# Altium schematic sheet Mirny.schdoc: Mirny
size A2; EDA_Number: ARTIQ; Projet: ARTIQ/SINARA; Author: M.Beldyga; CompanyName: WUT ISE; DrawnBy: K.B; Organization: WUT ISE; Address1: PW ISE; Address2: Nowowiejska 15/19 00-665 Warsaw; Address3: micbeldyga@gmail.com; SheetNumber: 1; SheetTotal: 10; ModifiedBy: M. Beldyga; CheckedDate: -; DivGrp: WUT ISE; Designer: K.B; ModifiedDate: -; ProjectName: Sensor Box
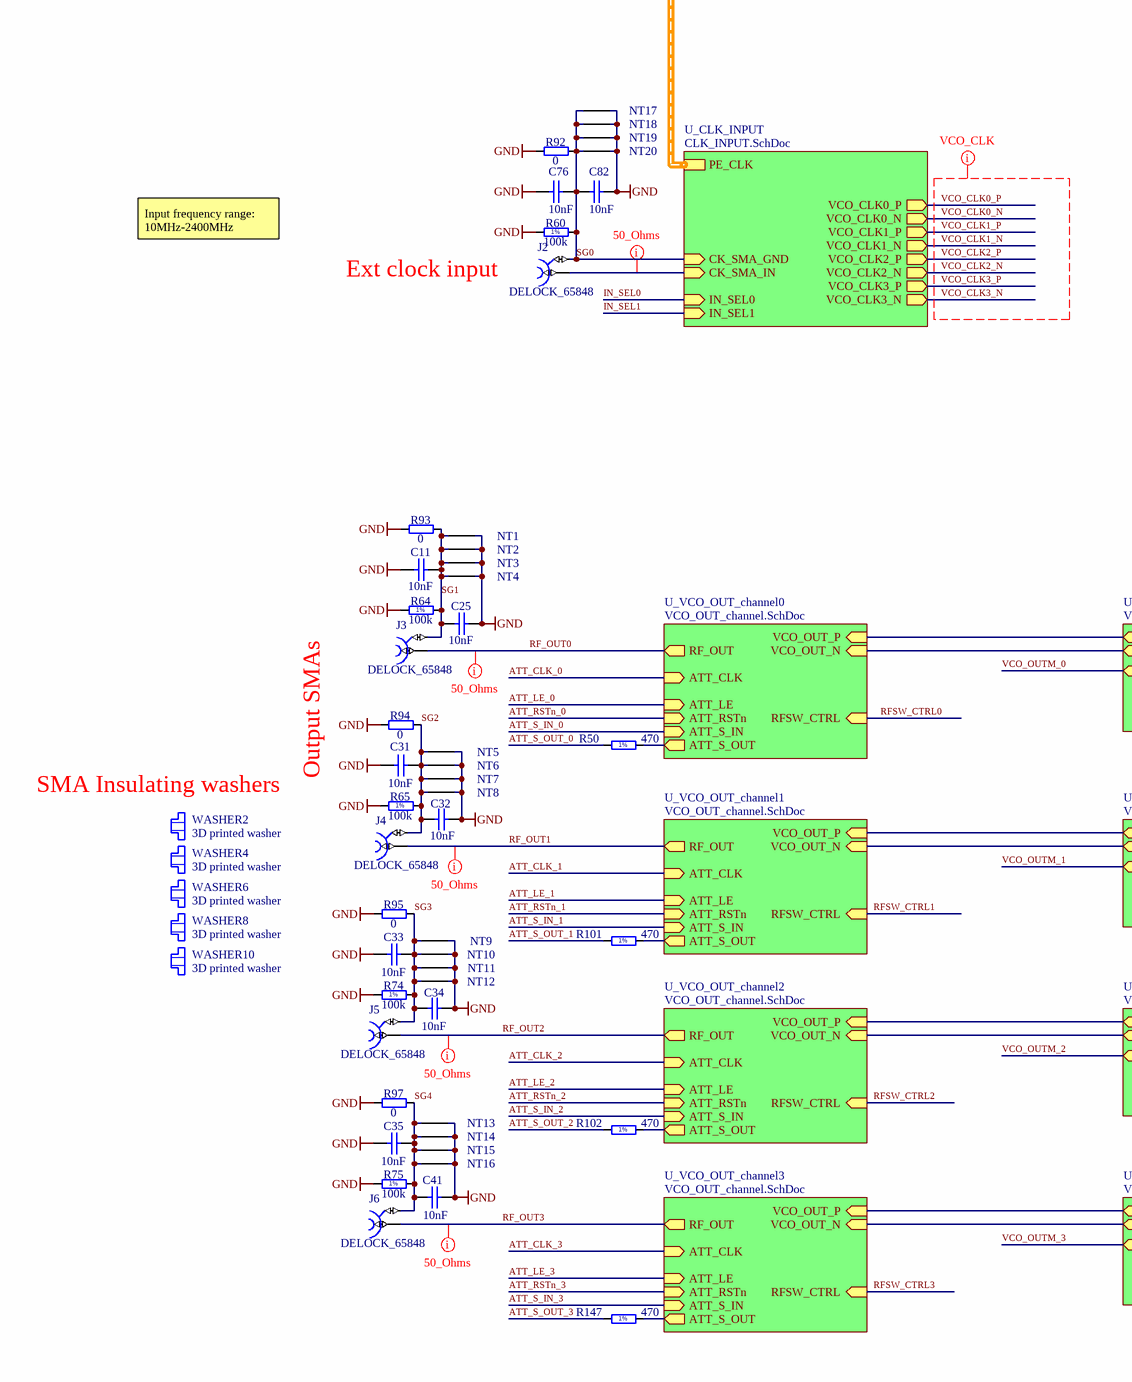
[diagram p0: Mirny.schdoc, left]
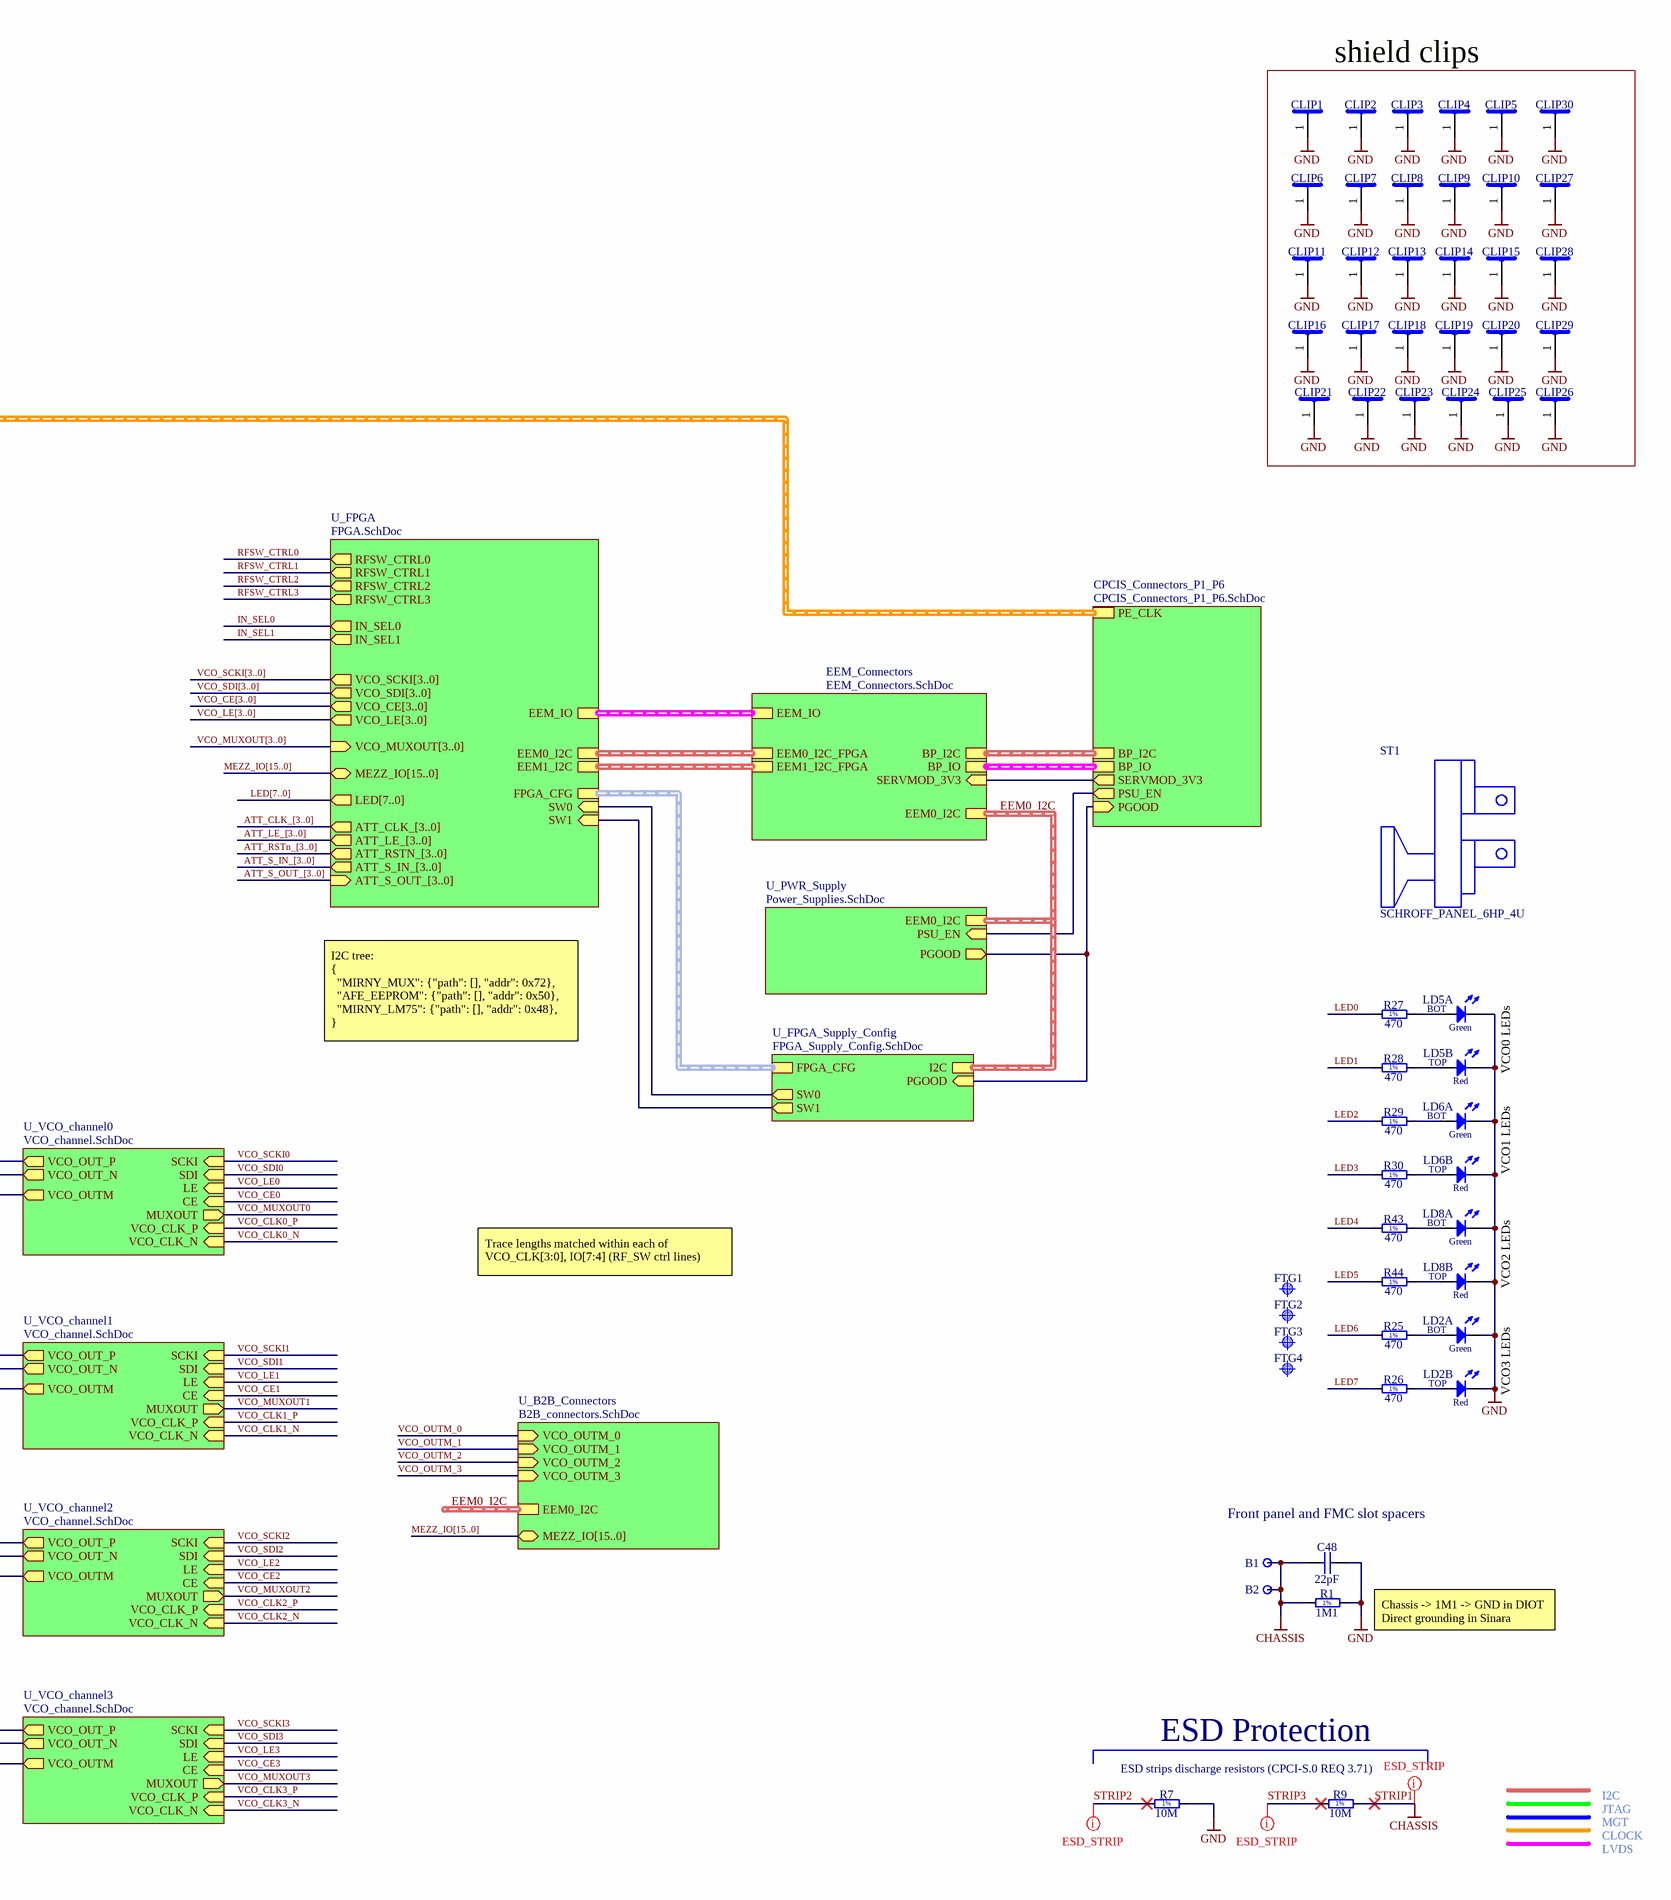
[diagram p1: Mirny.schdoc, right]

## Parts
B1  Plated Hole  [MTG270_500]  (value not drawn)  (no BOM)
B2  Plated Hole  [MTG270_500]  (value not drawn)  (no BOM)
C11  10nF  [CAPC1005X55N]
C25  10nF  [CAPC1005X55N]
C31  10nF  [CAPC1005X55N]
C32  10nF  [CAPC1005X55N]
C33  10nF  [CAPC1005X55N]
C34  10nF  [CAPC1005X55N]
C35  10nF  [CAPC1005X55N]
C41  10nF  [CAPC1005X55N]
C48  22pF  [CAPC1005X55N]
C76  10nF  [CAPC1005X55N]
C82  10nF  [CAPC1005X55N]
CLIP1  S1411-46R  [CLIP_HOLLAND-SHIELDING_LC]  (value not drawn)
CLIP2  S1411-46R  [CLIP_HOLLAND-SHIELDING_LC]  (value not drawn)
CLIP3  S1411-46R  [CLIP_HOLLAND-SHIELDING_LC]  (value not drawn)
CLIP4  S1411-46R  [CLIP_HOLLAND-SHIELDING_LC]  (value not drawn)
CLIP5  S1411-46R  [CLIP_HOLLAND-SHIELDING_LC]  (value not drawn)
CLIP6  S1411-46R  [CLIP_HOLLAND-SHIELDING_LC]  (value not drawn)
CLIP7  S1411-46R  [CLIP_HOLLAND-SHIELDING_LC]  (value not drawn)
CLIP8  S1411-46R  [CLIP_HOLLAND-SHIELDING_LC]  (value not drawn)
CLIP9  S1411-46R  [CLIP_HOLLAND-SHIELDING_LC]  (value not drawn)
CLIP10  S1411-46R  [CLIP_HOLLAND-SHIELDING_LC]  (value not drawn)
CLIP11  S1411-46R  [CLIP_HOLLAND-SHIELDING_LC]  (value not drawn)
CLIP12  S1411-46R  [CLIP_HOLLAND-SHIELDING_LC]  (value not drawn)
CLIP13  S1411-46R  [CLIP_HOLLAND-SHIELDING_LC]  (value not drawn)
CLIP14  S1411-46R  [CLIP_HOLLAND-SHIELDING_LC]  (value not drawn)
CLIP15  S1411-46R  [CLIP_HOLLAND-SHIELDING_LC]  (value not drawn)
CLIP16  S1411-46R  [CLIP_HOLLAND-SHIELDING_LC]  (value not drawn)
CLIP17  S1411-46R  [CLIP_HOLLAND-SHIELDING_LC]  (value not drawn)
CLIP18  S1411-46R  [CLIP_HOLLAND-SHIELDING_LC]  (value not drawn)
CLIP19  S1411-46R  [CLIP_HOLLAND-SHIELDING_LC]  (value not drawn)
CLIP20  S1411-46R  [CLIP_HOLLAND-SHIELDING_LC]  (value not drawn)
CLIP21  S1411-46R  [CLIP_HOLLAND-SHIELDING_LC]  (value not drawn)
CLIP22  S1411-46R  [CLIP_HOLLAND-SHIELDING_LC]  (value not drawn)
CLIP23  S1411-46R  [CLIP_HOLLAND-SHIELDING_LC]  (value not drawn)
CLIP24  S1411-46R  [CLIP_HOLLAND-SHIELDING_LC]  (value not drawn)
CLIP25  S1411-46R  [CLIP_HOLLAND-SHIELDING_LC]  (value not drawn)
CLIP26  S1411-46R  [CLIP_HOLLAND-SHIELDING_LC]  (value not drawn)
CLIP27  S1411-46R  [CLIP_HOLLAND-SHIELDING_LC]  (value not drawn)
CLIP28  S1411-46R  [CLIP_HOLLAND-SHIELDING_LC]  (value not drawn)
CLIP29  S1411-46R  [CLIP_HOLLAND-SHIELDING_LC]  (value not drawn)
CLIP30  S1411-46R  [CLIP_HOLLAND-SHIELDING_LC]  (value not drawn)
FTG1  Use only in PCB  [FIDUCIAL_TOP_C100-200]  (value not drawn)  (no BOM)
FTG2  Use only in PCB  [FIDUCIAL_TOP_S100-200]  (value not drawn)  (no BOM)
FTG3  Use only in PCB  [FIDUCIAL_TOP_S200-400]  (value not drawn)  (no BOM)
FTG4  Use only in PCB  [FIDUCIAL_TOP_S100-200]  (value not drawn)  (no BOM)
J2  DELOCK_65848  [Delock]
J3  DELOCK_65848  [Delock]
J4  DELOCK_65848  [Delock]
J5  DELOCK_65848  [Delock]
J6  DELOCK_65848  [Delock]
LD2  Red/Green  [LED_DIALIGHT_571-0112F]  (value not drawn)  (parts A,B of 2)
LD5  Red/Green  [LED_DIALIGHT_571-0112F]  (value not drawn)  (parts A,B of 2)
LD6  Red/Green  [LED_DIALIGHT_571-0112F]  (value not drawn)  (parts A,B of 2)
LD8  Red/Green  [LED_DIALIGHT_571-0112F]  (value not drawn)  (parts A,B of 2)
NT1  Net Tie  [Net Tie]  (value not drawn)  (net tie, no BOM)
NT2  Net Tie  [Net Tie]  (value not drawn)  (net tie, no BOM)
NT3  Net Tie  [Net Tie]  (value not drawn)  (net tie, no BOM)
NT4  Net Tie  [Net Tie]  (value not drawn)  (net tie, no BOM)
NT5  Net Tie  [Net Tie]  (value not drawn)  (net tie, no BOM)
NT6  Net Tie  [Net Tie]  (value not drawn)  (net tie, no BOM)
NT7  Net Tie  [Net Tie]  (value not drawn)  (net tie, no BOM)
NT8  Net Tie  [Net Tie]  (value not drawn)  (net tie, no BOM)
NT9  Net Tie  [Net Tie]  (value not drawn)  (net tie, no BOM)
NT10  Net Tie  [Net Tie]  (value not drawn)  (net tie, no BOM)
NT11  Net Tie  [Net Tie]  (value not drawn)  (net tie, no BOM)
NT12  Net Tie  [Net Tie]  (value not drawn)  (net tie, no BOM)
NT13  Net Tie  [Net Tie]  (value not drawn)  (net tie, no BOM)
NT14  Net Tie  [Net Tie]  (value not drawn)  (net tie, no BOM)
NT15  Net Tie  [Net Tie]  (value not drawn)  (net tie, no BOM)
NT16  Net Tie  [Net Tie]  (value not drawn)  (net tie, no BOM)
NT17  Net Tie  [Net Tie]  (value not drawn)  (net tie, no BOM)
NT18  Net Tie  [Net Tie]  (value not drawn)  (net tie, no BOM)
NT19  Net Tie  [Net Tie]  (value not drawn)  (net tie, no BOM)
NT20  Net Tie  [Net Tie]  (value not drawn)  (net tie, no BOM)
R1  1M1  [RESC2012X60N]
R7  10M  [RESC2113X55N]
R9  10M  [RESC2113X55N]
R25  470  [RESC1005X40N]
R26  470  [RESC1005X40N]
R27  470  [RESC1005X40N]
R28  470  [RESC1005X40N]
R29  470  [RESC1005X40N]
R30  470  [RESC1005X40N]
R43  470  [RESC1005X40N]
R44  470  [RESC1005X40N]
R50  470  [RESC1005X40N]
R60  100k  [RESC1005X40N]
R64  100k  [RESC1005X40N]
R65  100k  [RESC1005X40N]
R74  100k  [RESC1005X40N]
R75  100k  [RESC1005X40N]
R92  0  [RESC1608X55N]
R93  0  [RESC1608X55N]
R94  0  [RESC1608X55N]
R95  0  [RESC1608X55N]
R97  0  [RESC1608X55N]
R101  470  [RESC1005X40N]
R102  470  [RESC1005X40N]
R147  470  [RESC1005X40N]
ST1  SCHROFF_PANEL_6HP_4U  (mechanical)
WASHER2  3D printed washer  [Keystone_7687]
WASHER4  3D printed washer  [Keystone_7687]
WASHER6  3D printed washer  [Keystone_7687]
WASHER8  3D printed washer  [Keystone_7687]
WASHER10  3D printed washer  [Keystone_7687]

## Blocks framed on the sheet
shield clips: CLIP1-CLIP30

## Sub-sheets
CPCIS_Connectors_P1_P6 = CPCIS_Connectors_P1_P6.SchDoc: BP_I2C (harness I2C), SERVMOD_3V3 (out), PSU_EN (out), PE_CLK (harness CLK_DIFF), BP_IO (harness EEM_LVDS), PGOOD (in)
EEM_Connectors = EEM_Connectors.SchDoc: EEM_IO (harness EEM_LVDS), BP_IO (harness EEM_LVDS), EEM0_I2C (harness I2C), BP_I2C (harness I2C), SERVMOD_3V3 (in), EEM0_I2C_FPGA (harness I2C), EEM1_I2C_FPGA (harness I2C)
U_B2B_Connectors = B2B_connectors.SchDoc: VCO_OUTM_0 (in), MEZZ_IO[15..0] (bidir), VCO_OUTM_1 (in), VCO_OUTM_2 (in), VCO_OUTM_3 (in), EEM0_I2C (harness I2C)
U_CLK_INPUT = CLK_INPUT.SchDoc: CK_SMA_IN (in), IN_SEL0 (in), VCO_CLK0_P (out), VCO_CLK1_P (out), IN_SEL1 (in), VCO_CLK2_P (out), VCO_CLK3_P (out), VCO_CLK0_N (out), VCO_CLK3_N (out), VCO_CLK2_N (out), VCO_CLK1_N (out), CK_SMA_GND (in), PE_CLK (harness CLK_DIFF)
U_FPGA = FPGA.SchDoc: FPGA_CFG (harness FPGA_CFG), SW0 (in), SW1 (in), EEM1_I2C (harness I2C), EEM0_I2C (harness I2C), EEM_IO (harness EEM_LVDS), RFSW_CTRL1 (out), RFSW_CTRL2 (out), RFSW_CTRL3 (out), RFSW_CTRL0 (out), VCO_CE[3..0] (out), VCO_SCKI[3..0] (out), VCO_SDI[3..0] (out), ATT_CLK_[3..0] (out), ATT_LE_[3..0] (out), ATT_RSTN_[3..0] (out), ATT_S_IN_[3..0] (out), ATT_S_OUT_[3..0] (in), LED[7..0] (out), VCO_MUXOUT[3..0] (in), VCO_LE[3..0] (out), IN_SEL0 (out), IN_SEL1 (out), MEZZ_IO[15..0] (bidir)
U_FPGA_Supply_Config = FPGA_Supply_Config.SchDoc: FPGA_CFG (harness FPGA_CFG), PGOOD (in), SW0 (out), SW1 (out), I2C (harness I2C)
U_PWR_Supply = Power_Supplies.SchDoc: PSU_EN (in), EEM0_I2C (harness I2C), PGOOD (out)
U_VCO_channel0 = VCO_channel.SchDoc: SCKI (in), SDI (in), CE (in), LE (in), VCO_OUT_P (out), VCO_OUT_N (out), MUXOUT (out), VCO_CLK_P (in), VCO_OUTM (out), VCO_CLK_N (in)
U_VCO_channel1 = VCO_channel.SchDoc: SCKI (in), SDI (in), LE (in), VCO_OUT_P (out), VCO_OUT_N (out), MUXOUT (out), CE (in), VCO_CLK_P (in), VCO_CLK_N (in), VCO_OUTM (out)
U_VCO_channel2 = VCO_channel.SchDoc: SCKI (in), SDI (in), LE (in), VCO_OUT_P (out), VCO_OUT_N (out), MUXOUT (out), CE (in), VCO_CLK_P (in), VCO_CLK_N (in), VCO_OUTM (out)
U_VCO_channel3 = VCO_channel.SchDoc: SCKI (in), SDI (in), LE (in), VCO_OUT_P (out), VCO_OUT_N (out), MUXOUT (out), CE (in), VCO_CLK_P (in), VCO_CLK_N (in), VCO_OUTM (out)
U_VCO_OUT_channel0 = VCO_OUT_channel.SchDoc: VCO_OUT_P (in), VCO_OUT_N (in), RF_OUT (out), RFSW_CTRL (in), ATT_CLK (in), ATT_S_IN (in), ATT_LE (in), ATT_RSTn (in), ATT_S_OUT (out)
U_VCO_OUT_channel1 = VCO_OUT_channel.SchDoc: VCO_OUT_P (in), VCO_OUT_N (in), RF_OUT (out), RFSW_CTRL (in), ATT_CLK (in), ATT_S_IN (in), ATT_LE (in), ATT_RSTn (in), ATT_S_OUT (out)
U_VCO_OUT_channel2 = VCO_OUT_channel.SchDoc: VCO_OUT_P (in), VCO_OUT_N (in), RF_OUT (out), RFSW_CTRL (in), ATT_CLK (in), ATT_S_IN (in), ATT_LE (in), ATT_RSTn (in), ATT_S_OUT (out)
U_VCO_OUT_channel3 = VCO_OUT_channel.SchDoc: VCO_OUT_P (in), VCO_OUT_N (in), RF_OUT (out), RFSW_CTRL (in), ATT_CLK (in), ATT_S_IN (in), ATT_LE (in), ATT_RSTn (in), ATT_S_OUT (out)

## Nets
GND: C11.2 C25.1 C31.2 C32.1 C33.2 C34.1 C35.2 C41.1 C48.2 C76.1 C82.2 CLIP1.1 CLIP2.1 CLIP3.1 CLIP4.1 CLIP5.1 CLIP6.1 CLIP7.1 CLIP8.1 CLIP9.1 CLIP10.1 CLIP11.1 CLIP12.1 CLIP13.1 CLIP14.1 CLIP15.1 CLIP16.1 CLIP17.1 CLIP18.1 CLIP19.1 CLIP20.1 CLIP21.1 CLIP22.1 CLIP23.1 CLIP24.1 CLIP25.1 CLIP26.1 CLIP27.1 CLIP28.1 CLIP29.1 CLIP30.1 LD2.1(C) LD2.3(C) LD5.1(C) LD5.3(C) LD6.1(C) LD6.3(C) LD8.1(C) LD8.3(C) NT1.2 NT2.2 NT3.2 NT4.2 NT5.2 NT6.2 NT7.2 NT8.2 NT9.2 NT10.2 NT11.2 NT12.2 NT13.2 NT14.2 NT15.2 NT16.2 NT17.2 NT18.2 NT19.2 NT20.2 R1.2 R7.2 R60.2 R64.2 R65.2 R74.2 R75.2 R92.1 R93.1 R94.1 R95.1 R97.1
STRIP1: B1.1 B2.1 C48.1 R1.1 R9.2  [also labelled CHASSIS]
ATT_CLK_0: sheet U_VCO_OUT_channel0/ATT_CLK
ATT_CLK_1: sheet U_VCO_OUT_channel1/ATT_CLK
ATT_CLK_2: sheet U_VCO_OUT_channel2/ATT_CLK
ATT_CLK_3: sheet U_VCO_OUT_channel3/ATT_CLK
ATT_LE_0: sheet U_VCO_OUT_channel0/ATT_LE
ATT_LE_1: sheet U_VCO_OUT_channel1/ATT_LE
ATT_LE_2: sheet U_VCO_OUT_channel2/ATT_LE
ATT_LE_3: sheet U_VCO_OUT_channel3/ATT_LE
ATT_RSTn_0: sheet U_VCO_OUT_channel0/ATT_RSTn
ATT_RSTn_1: sheet U_VCO_OUT_channel1/ATT_RSTn
ATT_RSTn_2: sheet U_VCO_OUT_channel2/ATT_RSTn
ATT_RSTn_3: sheet U_VCO_OUT_channel3/ATT_RSTn
ATT_S_IN_0: sheet U_VCO_OUT_channel0/ATT_S_IN
ATT_S_IN_1: sheet U_VCO_OUT_channel1/ATT_S_IN
ATT_S_IN_2: sheet U_VCO_OUT_channel2/ATT_S_IN
ATT_S_IN_3: sheet U_VCO_OUT_channel3/ATT_S_IN
ATT_S_OUT_0: R50.1
ATT_S_OUT_1: R101.1
ATT_S_OUT_2: R102.1
ATT_S_OUT_3: R147.1
IN_SEL0: sheet U_CLK_INPUT/IN_SEL0, sheet U_FPGA/IN_SEL0
IN_SEL1: sheet U_CLK_INPUT/IN_SEL1, sheet U_FPGA/IN_SEL1
LED0: R27.1
LED1: R28.1
LED2: R29.1
LED3: R30.1
LED4: R43.1
LED5: R44.1
LED6: R25.1
LED7: R26.1
RF_OUT0: J3.1 ; sheet U_VCO_OUT_channel0/RF_OUT
RF_OUT1: J4.1 ; sheet U_VCO_OUT_channel1/RF_OUT
RF_OUT2: J5.1 ; sheet U_VCO_OUT_channel2/RF_OUT
RF_OUT3: J6.1 ; sheet U_VCO_OUT_channel3/RF_OUT
RFSW_CTRL0: sheet U_VCO_OUT_channel0/RFSW_CTRL, sheet U_FPGA/RFSW_CTRL0
RFSW_CTRL1: sheet U_VCO_OUT_channel1/RFSW_CTRL, sheet U_FPGA/RFSW_CTRL1
RFSW_CTRL2: sheet U_VCO_OUT_channel2/RFSW_CTRL, sheet U_FPGA/RFSW_CTRL2
RFSW_CTRL3: sheet U_VCO_OUT_channel3/RFSW_CTRL, sheet U_FPGA/RFSW_CTRL3
SG0: C76.2 C82.1 J2.2 NT17.1 NT18.1 NT19.1 NT20.1 R60.1 R92.2 ; sheet U_CLK_INPUT/CK_SMA_GND
SG1: C11.1 C25.2 J3.2 NT1.1 NT2.1 NT3.1 NT4.1 R64.1 R93.2
SG2: C31.1 C32.2 J4.2 NT5.1 NT6.1 NT7.1 NT8.1 R65.1 R94.2
SG3: C33.1 C34.2 J5.2 NT9.1 NT10.1 NT11.1 NT12.1 R74.1 R95.2
SG4: C35.1 C41.2 J6.2 NT13.1 NT14.1 NT15.1 NT16.1 R75.1 R97.2
STRIP2: R7.1
STRIP3: R9.1
VCO_CE0: sheet U_VCO_channel0/CE
VCO_CE1: sheet U_VCO_channel1/CE
VCO_CE2: sheet U_VCO_channel2/CE
VCO_CE3: sheet U_VCO_channel3/CE
VCO_CLK0_N: sheet U_VCO_channel0/VCO_CLK_N, sheet U_CLK_INPUT/VCO_CLK0_N
VCO_CLK0_P: sheet U_VCO_channel0/VCO_CLK_P, sheet U_CLK_INPUT/VCO_CLK0_P
VCO_CLK1_N: sheet U_VCO_channel1/VCO_CLK_N, sheet U_CLK_INPUT/VCO_CLK1_N
VCO_CLK1_P: sheet U_VCO_channel1/VCO_CLK_P, sheet U_CLK_INPUT/VCO_CLK1_P
VCO_CLK2_N: sheet U_VCO_channel2/VCO_CLK_N, sheet U_CLK_INPUT/VCO_CLK2_N
VCO_CLK2_P: sheet U_VCO_channel2/VCO_CLK_P, sheet U_CLK_INPUT/VCO_CLK2_P
VCO_CLK3_N: sheet U_VCO_channel3/VCO_CLK_N, sheet U_CLK_INPUT/VCO_CLK3_N
VCO_CLK3_P: sheet U_VCO_channel3/VCO_CLK_P, sheet U_CLK_INPUT/VCO_CLK3_P
VCO_LE0: sheet U_VCO_channel0/LE
VCO_LE1: sheet U_VCO_channel1/LE
VCO_LE2: sheet U_VCO_channel2/LE
VCO_LE3: sheet U_VCO_channel3/LE
VCO_MUXOUT0: sheet U_VCO_channel0/MUXOUT
VCO_MUXOUT1: sheet U_VCO_channel1/MUXOUT
VCO_MUXOUT2: sheet U_VCO_channel2/MUXOUT
VCO_MUXOUT3: sheet U_VCO_channel3/MUXOUT
VCO_OUTM_0: sheet U_VCO_channel0/VCO_OUTM, sheet U_B2B_Connectors/VCO_OUTM_0
VCO_OUTM_1: sheet U_VCO_channel1/VCO_OUTM, sheet U_B2B_Connectors/VCO_OUTM_1
VCO_OUTM_2: sheet U_VCO_channel2/VCO_OUTM, sheet U_B2B_Connectors/VCO_OUTM_2
VCO_OUTM_3: sheet U_VCO_channel3/VCO_OUTM, sheet U_B2B_Connectors/VCO_OUTM_3
VCO_SCKI0: sheet U_VCO_channel0/SCKI
VCO_SCKI1: sheet U_VCO_channel1/SCKI
VCO_SCKI2: sheet U_VCO_channel2/SCKI
VCO_SCKI3: sheet U_VCO_channel3/SCKI
VCO_SDI0: sheet U_VCO_channel0/SDI
VCO_SDI1: sheet U_VCO_channel1/SDI
VCO_SDI2: sheet U_VCO_channel2/SDI
VCO_SDI3: sheet U_VCO_channel3/SDI
NetJ2_1: J2.1 ; sheet U_CLK_INPUT/CK_SMA_IN
NetLD2_2: LD2.2(A) R25.2
NetLD2_4: LD2.4(A) R26.2
NetLD5_2: LD5.2(A) R27.2
NetLD5_4: LD5.4(A) R28.2
NetLD6_2: LD6.2(A) R29.2
NetLD6_4: LD6.4(A) R30.2
NetLD8_2: LD8.2(A) R43.2
NetLD8_4: LD8.4(A) R44.2
NetR50_2: R50.2 ; sheet U_VCO_OUT_channel0/ATT_S_OUT
NetR101_2: R101.2 ; sheet U_VCO_OUT_channel1/ATT_S_OUT
NetR102_2: R102.2 ; sheet U_VCO_OUT_channel2/ATT_S_OUT
NetR147_2: R147.2 ; sheet U_VCO_OUT_channel3/ATT_S_OUT
(unnamed): sheet U_VCO_channel0/VCO_OUT_P, sheet U_VCO_OUT_channel0/VCO_OUT_P
(unnamed): sheet U_VCO_channel0/VCO_OUT_N, sheet U_VCO_OUT_channel0/VCO_OUT_N
(unnamed): sheet U_VCO_OUT_channel1/VCO_OUT_P, sheet U_VCO_channel1/VCO_OUT_P
(unnamed): sheet U_VCO_OUT_channel1/VCO_OUT_N, sheet U_VCO_channel1/VCO_OUT_N
(unnamed): sheet U_VCO_OUT_channel2/VCO_OUT_P, sheet U_VCO_channel2/VCO_OUT_P
(unnamed): sheet U_VCO_OUT_channel2/VCO_OUT_N, sheet U_VCO_channel2/VCO_OUT_N
(unnamed): sheet U_VCO_OUT_channel3/VCO_OUT_P, sheet U_VCO_channel3/VCO_OUT_P
(unnamed): sheet U_VCO_OUT_channel3/VCO_OUT_N, sheet U_VCO_channel3/VCO_OUT_N
(unnamed): sheet U_PWR_Supply/PSU_EN, sheet CPCIS_Connectors_P1_P6/PSU_EN
(unnamed): sheet U_PWR_Supply/PGOOD, sheet CPCIS_Connectors_P1_P6/PGOOD, sheet U_FPGA_Supply_Config/PGOOD
(unnamed): sheet CPCIS_Connectors_P1_P6/SERVMOD_3V3, sheet EEM_Connectors/SERVMOD_3V3
(unnamed): sheet U_FPGA_Supply_Config/SW0, sheet U_FPGA/SW0
(unnamed): sheet U_FPGA_Supply_Config/SW1, sheet U_FPGA/SW1

## Buses and harness runs
bus ATT_CLK_[3..0] = sheet U_FPGA/ATT_CLK_[3..0]
bus ATT_LE_[3..0] = sheet U_FPGA/ATT_LE_[3..0]
bus ATT_RSTn_[3..0] = sheet U_FPGA/ATT_RSTN_[3..0]
bus ATT_S_IN_[3..0] = sheet U_FPGA/ATT_S_IN_[3..0]
bus ATT_S_OUT_[3..0] = sheet U_FPGA/ATT_S_OUT_[3..0]
bus LED[7..0] = sheet U_FPGA/LED[7..0]
bus MEZZ_IO[15..0] = sheet U_B2B_Connectors/MEZZ_IO[15..0]
bus MEZZ_IO[15..0] = sheet U_FPGA/MEZZ_IO[15..0]
bus VCO_CE[3..0] = sheet U_FPGA/VCO_CE[3..0]
bus VCO_LE[3..0] = sheet U_FPGA/VCO_LE[3..0]
bus VCO_MUXOUT[3..0] = sheet U_FPGA/VCO_MUXOUT[3..0]
bus VCO_SCKI[3..0] = sheet U_FPGA/VCO_SCKI[3..0]
bus VCO_SDI[3..0] = sheet U_FPGA/VCO_SDI[3..0]
harness EEM0_I2C = sheet EEM_Connectors/EEM0_I2C = sheet U_FPGA_Supply_Config/I2C = sheet U_PWR_Supply/EEM0_I2C
harness EEM0_I2C = sheet U_B2B_Connectors/EEM0_I2C
harness sheet CPCIS_Connectors_P1_P6/BP_I2C = sheet EEM_Connectors/BP_I2C
harness sheet CPCIS_Connectors_P1_P6/BP_IO = sheet EEM_Connectors/BP_IO
harness sheet CPCIS_Connectors_P1_P6/PE_CLK = sheet U_CLK_INPUT/PE_CLK
harness sheet EEM_Connectors/EEM0_I2C_FPGA = sheet U_FPGA/EEM0_I2C
harness sheet EEM_Connectors/EEM1_I2C_FPGA = sheet U_FPGA/EEM1_I2C
harness sheet EEM_Connectors/EEM_IO = sheet U_FPGA/EEM_IO
harness sheet U_FPGA/FPGA_CFG = sheet U_FPGA_Supply_Config/FPGA_CFG

## Layout directives
net class 50_Ohms: NetJ2_1, RF_OUT0, RF_OUT1, RF_OUT2, RF_OUT3
net class VCO_CLK: VCO_CLK0_N, VCO_CLK0_P, VCO_CLK1_N, VCO_CLK1_P, VCO_CLK2_N, VCO_CLK2_P, VCO_CLK3_N, VCO_CLK3_P
net class ESD_STRIP: STRIP1, STRIP2, STRIP3

## Notes on the sheet
- Input frequency range:
  10MHz-2400MHz
- (near J2) Ext clock input
- I2C tree:
  {
  "MIRNY_MUX": {"path": [], "addr": 0x72},
  "AFE_EEPROM": {"path": [], "addr": 0x50},
  "MIRNY_LM75": {"path": [], "addr": 0x48},
  }
- (near LD5) VCO0 LEDs
- (near LD6) VCO1 LEDs
- Trace lengths matched within each of VCO_CLK[3:0], IO[7:4] (RF_SW ctrl lines)
- (near LD8) VCO2 LEDs
- (near WASHER2) SMA Insulating washers
- Output SMAs
- (near LD2) VCO3 LEDs
- Front panel and FMC slot spacers
- Chassis -> 1M1 -> GND in DIOT
  Direct grounding in Sinara
- ESD Protection
- ESD strips discharge resistors (CPCI-S.0 REQ 3.71)
- I2C
- JTAG
- MGT
- CLOCK
- LVDS
- Project/Equipment
- Document
- Designer
- Drawn by
- Check.by
- Last Mod.
- Contact
- File
- Print Date
- Sheet
- Size
- A2
- of
- Rev
- (in symbol LED_DIALIGHT_571-0112F, part A) BOT; Green
- (in symbol LED_DIALIGHT_571-0112F, part B) TOP; Red
- (in symbol R0402_100K_1%_0.0625W_100PPM) 1%
- (in symbol R0402_470R_1%_0.0625W_100PPM) 1%
- (in symbol R0805_1M1_1%_0.125W_100PPM) 1%
- (in symbol R0805_10M_1%_0.125W_100PPM_VISHAY_CRCW e3) 1%

## Library data of the parts
B1 B2 = PLATED_HOLE2.7_PAD5.0: Single Terminal Socket; Part Description: Plated Through Hole: Hole Dia.=2.7mm Pad Dia.=5.0mm; Mounted: No; Part Number: PLATED_HOLE2.7_PAD5.0; Component Type: Standard (No BOM); Pin Count: 1; Family: Plated Hole; Socket: No; SMD: No; Sense: No; Status: None; ComponentHeight: 0mm; HelpURL: Undefined; Author: CERN DEM JMW; CreateDate: 27.09.2011; LatestRevisionDate: 27.09.2011; PackageDescription: Plated Through Hole: Hole Dia.=2.7mm Pad Dia.=5.0mm
C11 C25 C31-C35 C41 C76 C82 = CC0402_10NF_16V_10%_X7R: Non-polarised capacitor; Part Description: SMD Multilayer Chip Ceramic Capacitor; Manufacturer: GENERIC; Manufacturer1 Part Number: 223878715636; Voltage: 16V; TC: X7R; Tolerance: ±10%; Part Number: CC0402_10NF_16V_10%_X7R; Component Kind: Standard; Component Type: Standard; Pin Count: 2; Value: 10nF; Status: Not Recommended; Manufacturer Part Number: CC0402_10NF_16V_10%_X7R; Case: 0402; Mounted: Yes; Socket: No; SMD: Yes; Sense: No; Manufacturer1 Example: PHYCOMP; Manufacturer1 ComponentHeight: 0.55mm; HelpURL: \\cern.ch\dfs\Applications\Altium\Datasheets\CC0402_X7R_PHYCOMP.pdf; Author: CERN DEM JLC; CreateDate: 2007-12-03; LatestRevisionDate: 2007-12-03
C48 = CC0402_22PF_50V_5%_C0G: Non-polarised capacitor; Part Description: SMD Multilayer Chip Ceramic Capacitor; Manufacturer: GENERIC; Manufacturer1 Part Number: C0402C220J5GACTU; Voltage: 50V; TC: C0G/NP0; Tolerance: ±5%; Part Number: CC0402_22PF_50V_5%_C0G; Component Kind: Standard; Component Type: Standard; Pin Count: 2; Value: 22pF; Status: Preferred; Manufacturer Part Number: CC0402_22PF_50V_5%_C0G; Case: 0402; Mounted: Yes; Socket: No; SMD: Yes; Manufacturer1 Example: KEMET; Manufacturer1 ComponentHeight: 0.55mm; HelpURL: \\cern.ch\dfs\Applications\Altium\Datasheets\CC0402_C0G_KEMET_(Commercial Grade).pdf; Author: CERN DEM JLC; CreateDate: 2007-12-03; LatestRevisionDate: 2007-12-03; Sense: No
CLIP1-CLIP30 = SHIELD_CLIP: Surface Mount Clip for PCB Screening Covers; Part Description: Surface Mount Clip for PCB Screening Covers, 1500 Serie; Manufacturer: HARWIN; PressFit: No; Table: Metal Screening Box; Part Number: S1411-46R; Component Kind: Standard; Component Type: Standard; Pin Count: 1; PackageDescription: Surface Mount Clip for PCB Screening Covers, 1500 Serie; Mounted: Yes; Socket: No; SMD: Yes; Status: None; Manufacturer Part Number: S1411-46R; ComponentHeight: 3.5mm; HelpURL: \\cern.ch\dfs\Applications\Altium\Datasheets\CLIP_HOLLAND-SHIELDING_LC.pdf; Author: CERN DEM JLC; CreateDate: 2013-06-25; LatestRevisionDate: 2013-06-25
FTG1 = FIDUCIAL_TARGET_C100-200: Fiducial Target; Part Description: Round Fiducial Target, Top Layer, 1.0mm, Top Solder 2.0mm, Keepout =2.0mm; Mounted: No; Part Number: FIDUCIAL_TARGET_C100-200; Component Type: Standard (No BOM); Pin Count: 1; Family: Fiducial; Socket: No; SMD: Yes; Sense: No; Status: None; ComponentHeight: 0mm; HelpURL: Undefined; Author: CERN DEM JLC; CreateDate: 09.02.2010; LatestRevisionDate: 04.04.2012; PackageDescription: Round Fiducial Target, Top Layer, 1.0mm, Top Solder 2.0mm, Keepout =2.0mm
FTG2 FTG4 = FIDUCIAL_TARGET_S100-200: Fiducial Target; Part Description: Square Fiducial Target, Top Layer, 1.0mm, Top Solder 2.0mm, Keepout =2.0mm; Mounted: No; Part Number: FIDUCIAL_TARGET_S100-200; Component Type: Standard (No BOM); Pin Count: 1; Family: Fiducial; Socket: No; SMD: Yes; Sense: No; Status: None; ComponentHeight: 0mm; HelpURL: Undefined; Author: CERN DEM JLC; CreateDate: 09.02.2010; LatestRevisionDate: 04.04.2012; PackageDescription: Square Fiducial Target, Top Layer, 1.0mm, Top Solder 2.0mm, Keepout =2.0mm
FTG3 = FIDUCIAL_TARGET_S200-400: Fiducial Target; Part Description: Square Fiducial Target, Top Layer, 2.0mm, Top Solder 4.0mm, Keepout =4.0mm; Mounted: No; Part Number: FIDUCIAL_TARGET_S200-400; Component Type: Standard (No BOM); Pin Count: 1; Family: Fiducial; Socket: No; SMD: Yes; Sense: No; Status: None; ComponentHeight: 0mm; HelpURL: Undefined; Author: CERN DEM JLC; CreateDate: 02.06.2008; LatestRevisionDate: 04.04.2012; PackageDescription: Square Fiducial Target, Top Layer, 2.0mm, Top Solder 4.0mm, Keepout =4.0mm
J2-J6 = DELOCK_65848: 50 Ohm Through Hole SMA Right Angle PCB Jack; Manufacturer Part Number: 5848 (4043619658480)
LD2 LD5 LD6 LD8 = LED_DIALIGHT_571-0112F: 2x LED  Botom Green, Top Red; Part Description: Dual 2mm  LEDs, Red Top,Green Bot, CBI® Circuit Board Indicator (Without positioning pins); PressFit: No; Bonding: No; Part Number: LED_DIALIGHT_571-0112F; Component Kind: Standard; Component Type: Standard; Color: Red/Green; PackageDescription: 2x 2mm LED (Top: Red, Bot: Green) PCB Edge Mounting (Without positioning pins) DIALIGHT 571 Serie; Manufacturer: DIALIGHT; Manufacturer Part Number: 571-0112F; Pin Count: 4; Mounted: Yes; Socket: No; SMD: No; Sense: No; ComponentHeight: 8.6mm; HelpURL: \\cern.ch\dfs\Applications\Altium\Datasheets\LED_DIALIGHT_571-0112F.pdf; Author: CERN DEM JLC; CreateDate: 09.11.2009; LatestRevisionDate: 17.03.2010
NT1-NT20 = Net Tie: Part Description: Net Tie (2 Nets); Mounted: No; Part Number: Net Tie; Component Type: Net Tie; Pin Count: 2; Family: Net Tie; Socket: No; SMD: No; Sense: No; Status: None; ComponentHeight: 0mm; HelpURL: Undefined; Author: CERN DEM JLC; CreateDate: 22.03.2011; LatestRevisionDate: 22.03.2011; PackageDescription: 2 Plated Through Hole For Coaxial Cable Link: Hole Dia.=1.4mm Pad Dia.=2.5mm
R1 = R0805_1M1_1%_0.125W_100PPM: Resistor - 1%; Part Description: General Purpose Thick Film Chip Resistor; Manufacturer: GENERIC; Manufacturer1 Part Number: NRC10F1104TRF; PressFit: No; Part Number: R0805_1M1_1%_0.125W_100PPM; Component Kind: Standard; Component Type: Standard; Pin Count: 2; Value: 1M1; Status: Preferred; Manufacturer Part Number: R0805_1M1_1%_0.125W_100PPM; Case: 0805; Mounted: Yes; Sense: No; Socket: No; SMD: Yes; Manufacturer1 Example: NIC COMPONENT; Manufacturer1 ComponentHeight: 0.6mm; HelpURL: \\cern.ch\dfs\Applications\Altium\Datasheets\R0805_NIC_NRC.pdf; Author: CERN DEM JLC; CreateDate: 03/12/2007; LatestRevisionDate: 13/03/2008
R7 R9 = R0805_10M_1%_0.125W_100PPM_VISHAY_CRCW e3: Resistor - 1%; Part Description: 150V, Standard Thick Film Chip Resistor; Manufacturer: VISHAY DALE; Manufacturer Part Number: CRCW080510M0FKEA; Power: 0.125W; TC: ±100ppm/°C; PressFit: No; Part Number: R0805_10M_1%_0.125W_100PPM_VISHAY_CRCW e3; Component Kind: Standard; Component Type: Standard; Pin Count: 2; Value: 10M; Status: None; Tolerance: ±1%; Case: 0805; Mounted: Yes; Sense: No; Socket: No; SMD: Yes; ComponentHeight: 0.5mm; HelpURL: \\cern.ch\dfs\Applications\Altium\Datasheets\R0805_VISHAY_CRCW e3.pdf; Author: CERN DEM BC; CreateDate: 2019-11-12; LatestRevisionDate: 2019-11-12
R25-R30 R43 R44 R50 R101 R102 R147 = R0402_470R_1%_0.0625W_100PPM: Resistor - 1%; Part Description: General Purpose Thick Film Chip Resistor; Manufacturer: GENERIC; Manufacturer1 Part Number: 232270674701L; TC: ±100ppm/°C; PressFit: No; Part Number: R0402_470R_1%_0.0625W_100PPM; Component Kind: Standard; Component Type: Standard; Pin Count: 2; Value: 470; Status: Not Recommended; Power: 0.0625W; Tolerance: ±1%; Manufacturer Part Number: R0402_470R_1%_0.0625W_100PPM; Case: 0402; Mounted: Yes; Sense: No; Socket: No; SMD: Yes; Manufacturer1 Example: YAGEO PHYCOMP; Manufacturer1 ComponentHeight: 0.4mm; HelpURL: \\cern.ch\dfs\Applications\Altium\Datasheets\R0402_Phycomp_RC0402.pdf; Author: CERN DEM JLC; CreateDate: 03.12.2007; LatestRevisionDate: 17.10.2012
R60 R64 R65 R74 R75 = R0402_100K_1%_0.0625W_100PPM: Resistor - 1%; Part Description: General Purpose Thick Film Chip Resistor; Manufacturer: GENERIC; Manufacturer1 Part Number: 232270671004L; PressFit: No; TC: ±100ppm/°C; Part Number: R0402_100K_1%_0.0625W_100PPM; Component Kind: Standard; Component Type: Standard; Pin Count: 2; Value: 100k; Status: Not Recommended; Manufacturer Part Number: R0402_100K_1%_0.0625W_100PPM; Case: 0402; Mounted: Yes; Sense: No; Socket: No; SMD: Yes; Manufacturer1 Example: YAGEO PHYCOMP; Manufacturer1 ComponentHeight: 0.4mm; HelpURL: \\cern.ch\dfs\Applications\Altium\Datasheets\R0402_Phycomp_RC0402.pdf; Author: CERN DEM JLC; CreateDate: 03.12.2007; LatestRevisionDate: 17.10.2012; Power: 0.0625W; Tolerance: ±1%
R92-R95 R97 = R0603_0R_JUMPER: Resistor; Part Description: 1A (0.05R Max DC Resistance) Zero Ohm Jumper; Manufacturer: GENERIC; Manufacturer1 Part Number: NRC06Z0; PressFit: No; Part Number: R0603_0R_JUMPER; Component Kind: Standard; Component Type: Standard; Pin Count: 2; Value: 0; Status: Preferred; Manufacturer Part Number: R0603_0R_JUMPER; Case: 0603; Mounted: Yes; Sense: No; Socket: No; SMD: Yes; Manufacturer1 Example: NIC COMPONENT; Manufacturer1 ComponentHeight: 0.55mm; HelpURL: \\cern.ch\dfs\Applications\Altium\Datasheets\R0603_NIC_NRC.pdf; Author: CERN DEM JLC; CreateDate: 03.12.2007; LatestRevisionDate: 13.03.2008
ST1 = SCHROFF_PANEL_6HP_4U: Schroff 6HP 4U EUROCARD Panel; Manufacturer Part Number: 20818-020; Manufacturer: Schroff; Manufacturer Part Number 2: 20848-666
WASHER2 WASHER4 WASHER6 WASHER8 WASHER10 = Keystone_7687: SMA_Shoulder Washer; Part Description: Polyphenylene Sulfide PPS Shoulder Washer; Manufacturer: Homemade; PressFit: No; Value: D11.1xd6.6; Part Number: 3D printed washer; Component Kind: Standard; Component Type: Mechanical; Footprint: 3D printed washer; Pin Count: 0; PackageDescription: Polyphenylene Sulfide PPS Shoulder Washer; Mounted: Yes; Socket: No; SMD: No; Sense: No; Status: None; Manufacturer Part Number: 3D printed washer; ComponentHeight: 1.91mm; HelpURL: \\cern.ch\dfs\Applications\Altium\Datasheets\AAVID-THERMALLOY_7721-7PPSG.pdf; Author: GK; CreateDate: 28.01.2016; LatestRevisionDate: 28.01.2016